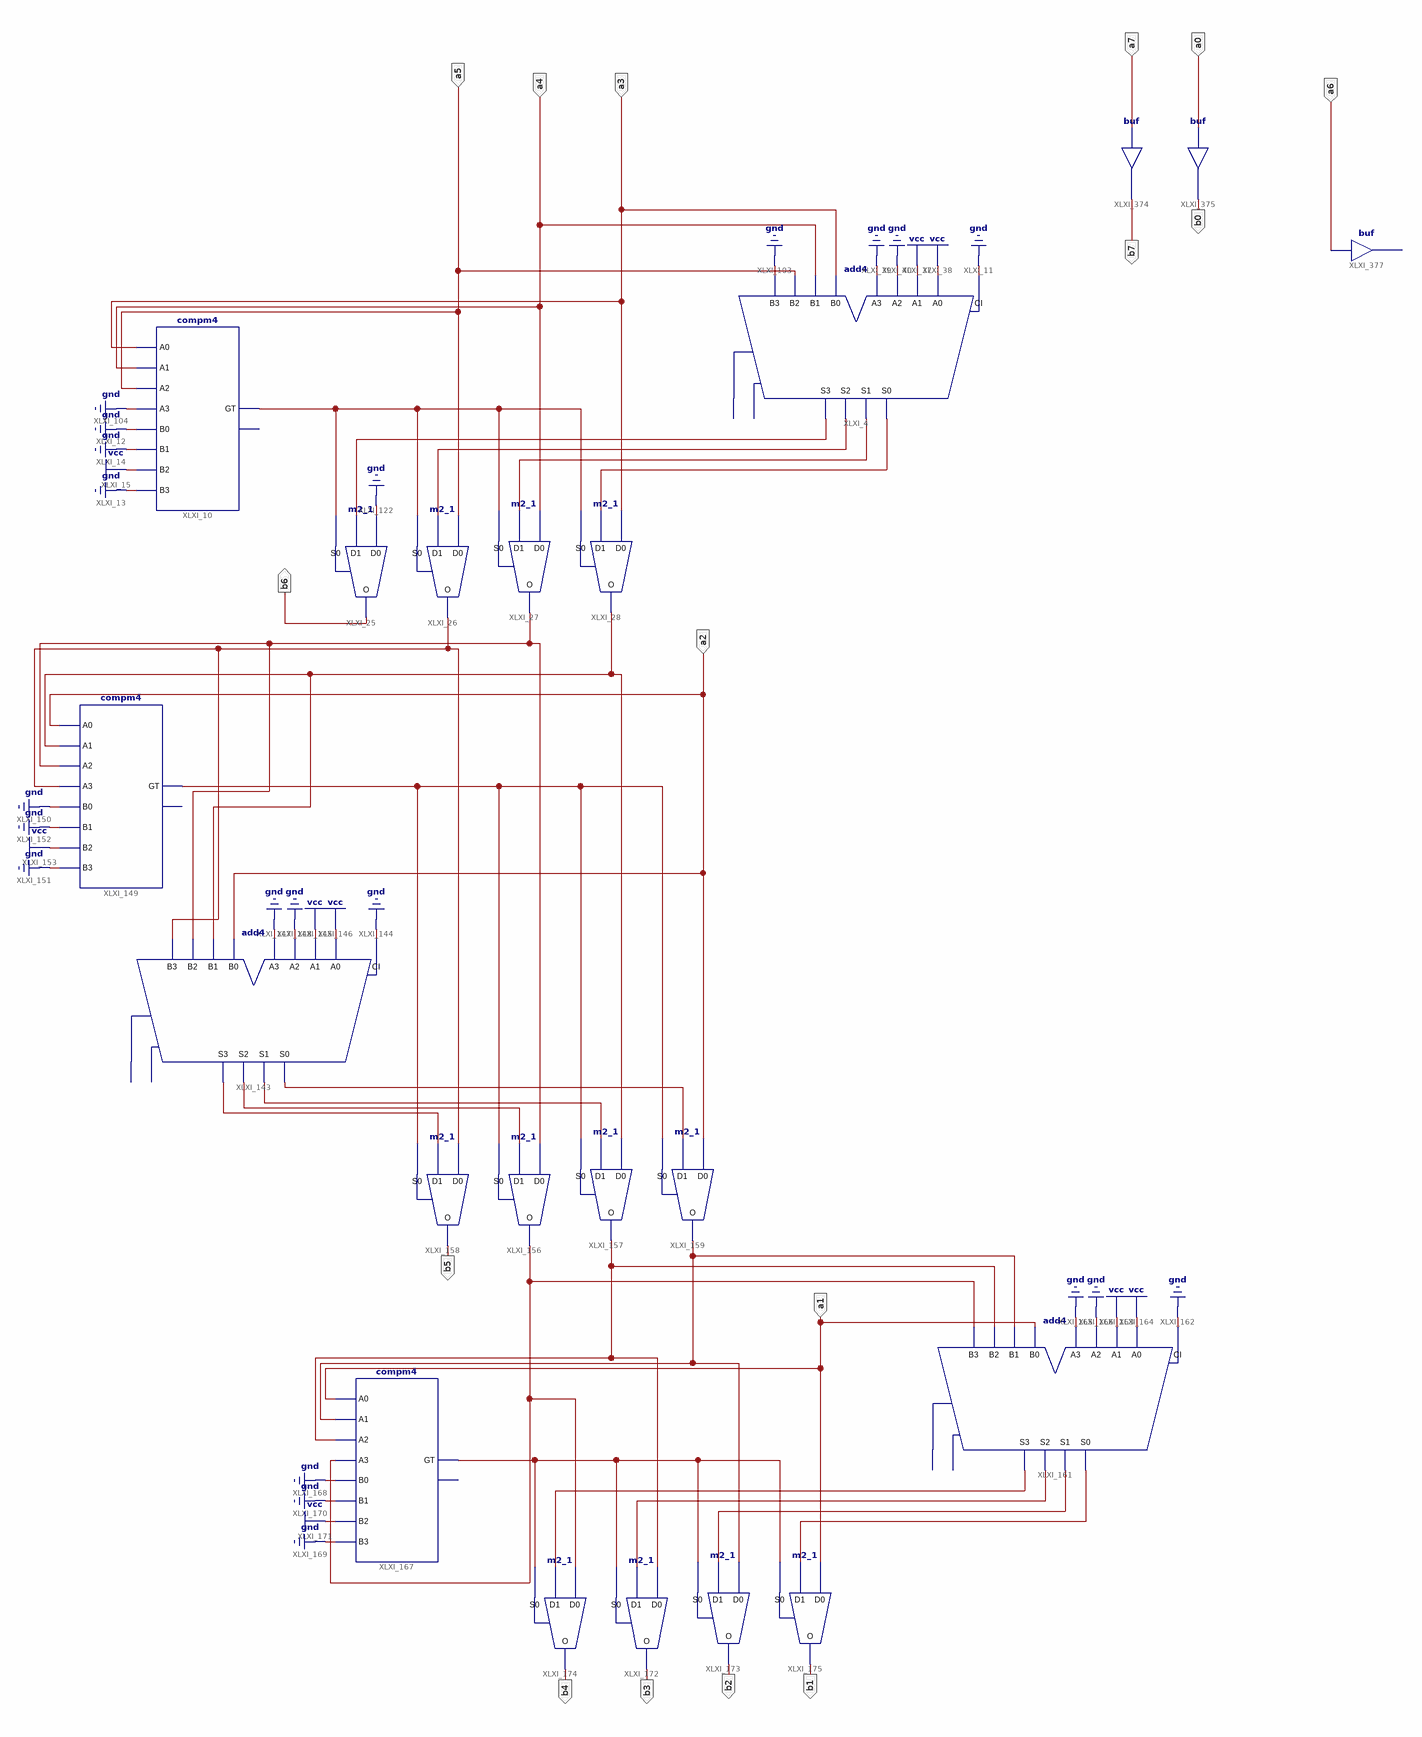
[diagram p0: schematic sheet 1]
// Xilinx ISE schematic bcd_design.sch (spartan3) as structural Verilog: 21 symbols, 16 ports
module bcd_design (
  input  a0,
  input  a7,
  input  a5,
  input  a4,
  input  a3,
  input  a2,
  input  a1,
  input  a6,
  output b6,
  output b5,
  output b4,
  output b3,
  output b2,
  output b1,
  output b0,
  output b7
);

  wire XLXN_23, XLXN_44, XLXN_45, XLXN_46, XLXN_47, XLXN_139, XLXN_145, XLXN_146, XLXN_147, XLXN_155,
       XLXN_156, XLXN_162, XLXN_163, XLXN_164, XLXN_170, XLXN_403, XLXN_404, XLXN_406, XLXN_408, XLXN_409,
       XLXN_410;

  add4 XLXI_4 (
    .A0(1'b1), .A1(1'b1), .A2(1'b0), .A3(1'b0), .B0(a3), .B1(a4), .B2(a5), .B3(1'b0), .CI(1'b0),
    .S0(XLXN_47), .S1(XLXN_46), .S2(XLXN_45), .S3(XLXN_44));  // open: CO, OFL
  compm4 XLXI_10 (
    .A0(a3), .A1(a4), .A2(a5), .A3(1'b0), .B0(1'b0), .B1(1'b0), .B2(1'b1), .B3(1'b0), .GT(XLXN_23));  // open: LT
  m2_1 XLXI_26 (.D0(a5), .D1(XLXN_45), .S0(XLXN_23), .O(XLXN_403));
  m2_1 XLXI_27 (.D0(a4), .D1(XLXN_46), .S0(XLXN_23), .O(XLXN_404));
  m2_1 XLXI_25 (.D0(1'b0), .D1(XLXN_44), .S0(XLXN_23), .O(b6));
  m2_1 XLXI_28 (.D0(a3), .D1(XLXN_47), .S0(XLXN_23), .O(XLXN_406));
  compm4 XLXI_149 (
    .A0(a2), .A1(XLXN_406), .A2(XLXN_404), .A3(XLXN_403), .B0(1'b0), .B1(1'b0), .B2(1'b1), .B3(1'b0),
    .GT(XLXN_139));  // open: LT
  add4 XLXI_143 (
    .A0(1'b1), .A1(1'b1), .A2(1'b0), .A3(1'b0), .B0(a2), .B1(XLXN_406), .B2(XLXN_404), .B3(XLXN_403),
    .CI(1'b0), .S0(XLXN_147), .S1(XLXN_146), .S2(XLXN_145), .S3(XLXN_155));  // open: CO, OFL
  m2_1 XLXI_156 (.D0(XLXN_404), .D1(XLXN_145), .S0(XLXN_139), .O(XLXN_408));
  m2_1 XLXI_157 (.D0(XLXN_406), .D1(XLXN_146), .S0(XLXN_139), .O(XLXN_409));
  m2_1 XLXI_158 (.D0(XLXN_403), .D1(XLXN_155), .S0(XLXN_139), .O(b5));
  m2_1 XLXI_159 (.D0(a2), .D1(XLXN_147), .S0(XLXN_139), .O(XLXN_410));
  add4 XLXI_161 (
    .A0(1'b1), .A1(1'b1), .A2(1'b0), .A3(1'b0), .B0(a1), .B1(XLXN_410), .B2(XLXN_409), .B3(XLXN_408),
    .CI(1'b0), .S0(XLXN_164), .S1(XLXN_163), .S2(XLXN_162), .S3(XLXN_170));  // open: CO, OFL
  compm4 XLXI_167 (
    .A0(a1), .A1(XLXN_410), .A2(XLXN_409), .A3(XLXN_408), .B0(1'b0), .B1(1'b0), .B2(1'b1), .B3(1'b0),
    .GT(XLXN_156));  // open: LT
  m2_1 XLXI_172 (.D0(XLXN_409), .D1(XLXN_162), .S0(XLXN_156), .O(b3));
  m2_1 XLXI_173 (.D0(XLXN_410), .D1(XLXN_163), .S0(XLXN_156), .O(b2));
  m2_1 XLXI_174 (.D0(XLXN_408), .D1(XLXN_170), .S0(XLXN_156), .O(b4));
  m2_1 XLXI_175 (.D0(a1), .D1(XLXN_164), .S0(XLXN_156), .O(b1));
  buf XLXI_375 (b0, a0);
  buf XLXI_374 (b7, a7);
  // buf XLXI_377 has open pins: I=a6, O=open
endmodule
